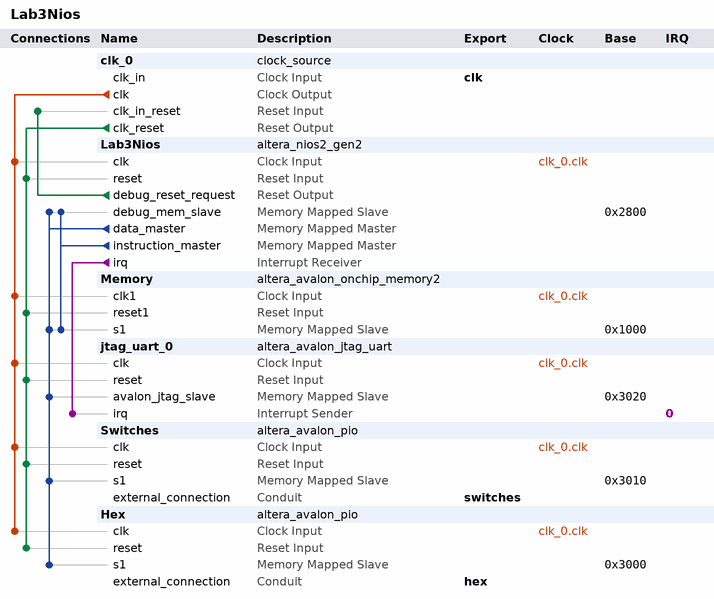
[diagram p0: system contents]
# Platform Designer (Qsys) system Lab3Nios, Cyclone V 5CSEMA5F31C6
# Parameters at their usual value, and those the tool derives, are not listed.
package require -exact qsys 20.1
create_system Lab3Nios
set_project_property DEVICE_FAMILY {Cyclone V}
set_project_property DEVICE 5CSEMA5F31C6

add_instance clk_0 clock_source 20.1
set_instance_parameter_value clk_0 clockFrequency 50000000

add_instance Lab3Nios altera_nios2_gen2 20.1
set_instance_parameter_value Lab3Nios dcache_size 2048
set_instance_parameter_value Lab3Nios exceptionSlave Memory.s1
set_instance_parameter_value Lab3Nios icache_size 4096
set_instance_parameter_value Lab3Nios impl Fast
set_instance_parameter_value Lab3Nios resetSlave Memory.s1

add_instance Memory altera_avalon_onchip_memory2 20.1
set_instance_parameter_value Memory dataWidth 32
set_instance_parameter_value Memory dualPort false
set_instance_parameter_value Memory initMemContent true
set_instance_parameter_value Memory initializationFileName onchip_mem.hex
set_instance_parameter_value Memory memorySize 4096

add_instance jtag_uart_0 altera_avalon_jtag_uart 20.1
set_instance_parameter_value jtag_uart_0 simInteractiveOptions NO_INTERACTIVE_WINDOWS

add_instance Switches altera_avalon_pio 20.1
set_instance_parameter_value Switches direction Input
set_instance_parameter_value Switches width 10

add_instance Hex altera_avalon_pio 20.1
set_instance_parameter_value Hex direction Output
set_instance_parameter_value Hex width 21

# connections
add_connection clk_0.clk Hex.clk clock
add_connection clk_0.clk jtag_uart_0.clk clock
add_connection clk_0.clk Lab3Nios.clk clock
add_connection clk_0.clk Memory.clk1 clock
add_connection clk_0.clk Switches.clk clock
add_connection clk_0.clk_reset Hex.reset reset
add_connection clk_0.clk_reset jtag_uart_0.reset reset
add_connection clk_0.clk_reset Lab3Nios.reset reset
add_connection clk_0.clk_reset Memory.reset1 reset
add_connection clk_0.clk_reset Switches.reset reset
add_connection Lab3Nios.debug_reset_request clk_0.clk_in_reset reset
add_connection Lab3Nios.data_master Hex.s1 avalon
set_connection_parameter_value Lab3Nios.data_master/Hex.s1 baseAddress 0x3000
add_connection Lab3Nios.data_master jtag_uart_0.avalon_jtag_slave avalon
set_connection_parameter_value Lab3Nios.data_master/jtag_uart_0.avalon_jtag_slave baseAddress 0x3020
add_connection Lab3Nios.data_master Lab3Nios.debug_mem_slave avalon
set_connection_parameter_value Lab3Nios.data_master/Lab3Nios.debug_mem_slave baseAddress 0x2800
add_connection Lab3Nios.data_master Memory.s1 avalon
set_connection_parameter_value Lab3Nios.data_master/Memory.s1 baseAddress 0x1000
add_connection Lab3Nios.data_master Switches.s1 avalon
set_connection_parameter_value Lab3Nios.data_master/Switches.s1 baseAddress 0x3010
add_connection Lab3Nios.instruction_master Lab3Nios.debug_mem_slave avalon
set_connection_parameter_value Lab3Nios.instruction_master/Lab3Nios.debug_mem_slave baseAddress 0x2800
add_connection Lab3Nios.instruction_master Memory.s1 avalon
set_connection_parameter_value Lab3Nios.instruction_master/Memory.s1 baseAddress 0x1000
add_connection Lab3Nios.irq jtag_uart_0.irq interrupt
set_connection_parameter_value Lab3Nios.irq/jtag_uart_0.irq irqNumber 0

# exported interfaces
add_interface clk clock sink
set_interface_property clk EXPORT_OF clk_0.clk_in
add_interface hex conduit end
set_interface_property hex EXPORT_OF Hex.external_connection
add_interface switches conduit end
set_interface_property switches EXPORT_OF Switches.external_connection

set_interconnect_requirement {$system} qsys_mm.clockCrossingAdapter HANDSHAKE
set_interconnect_requirement {$system} qsys_mm.enableEccProtection FALSE
set_interconnect_requirement {$system} qsys_mm.insertDefaultSlave FALSE
set_interconnect_requirement {$system} qsys_mm.maxAdditionalLatency 1

save_system Lab3Nios.qsys
